# Altium schematic sheet [2] MCU.SchDoc: BLE SoC
size A4; ApprovedBy: Muhammet YILDIZ; CheckedBy: Muhammet YILDIZ; Author: Muhammet YILDIZ; CompanyName: YıLDıZ IoT; DrawnBy: Muhammet YILDIZ; Engineer: Muhammet YILDIZ; Organization: YıLDıZ IoT; Address1: Elperek Mahallesi; Address2: Saray Sokak No:12; Address3: SAKARYA / TURKEY; Revision: 1; SheetNumber: 2; SheetTotal: 7; SheetSize: A4
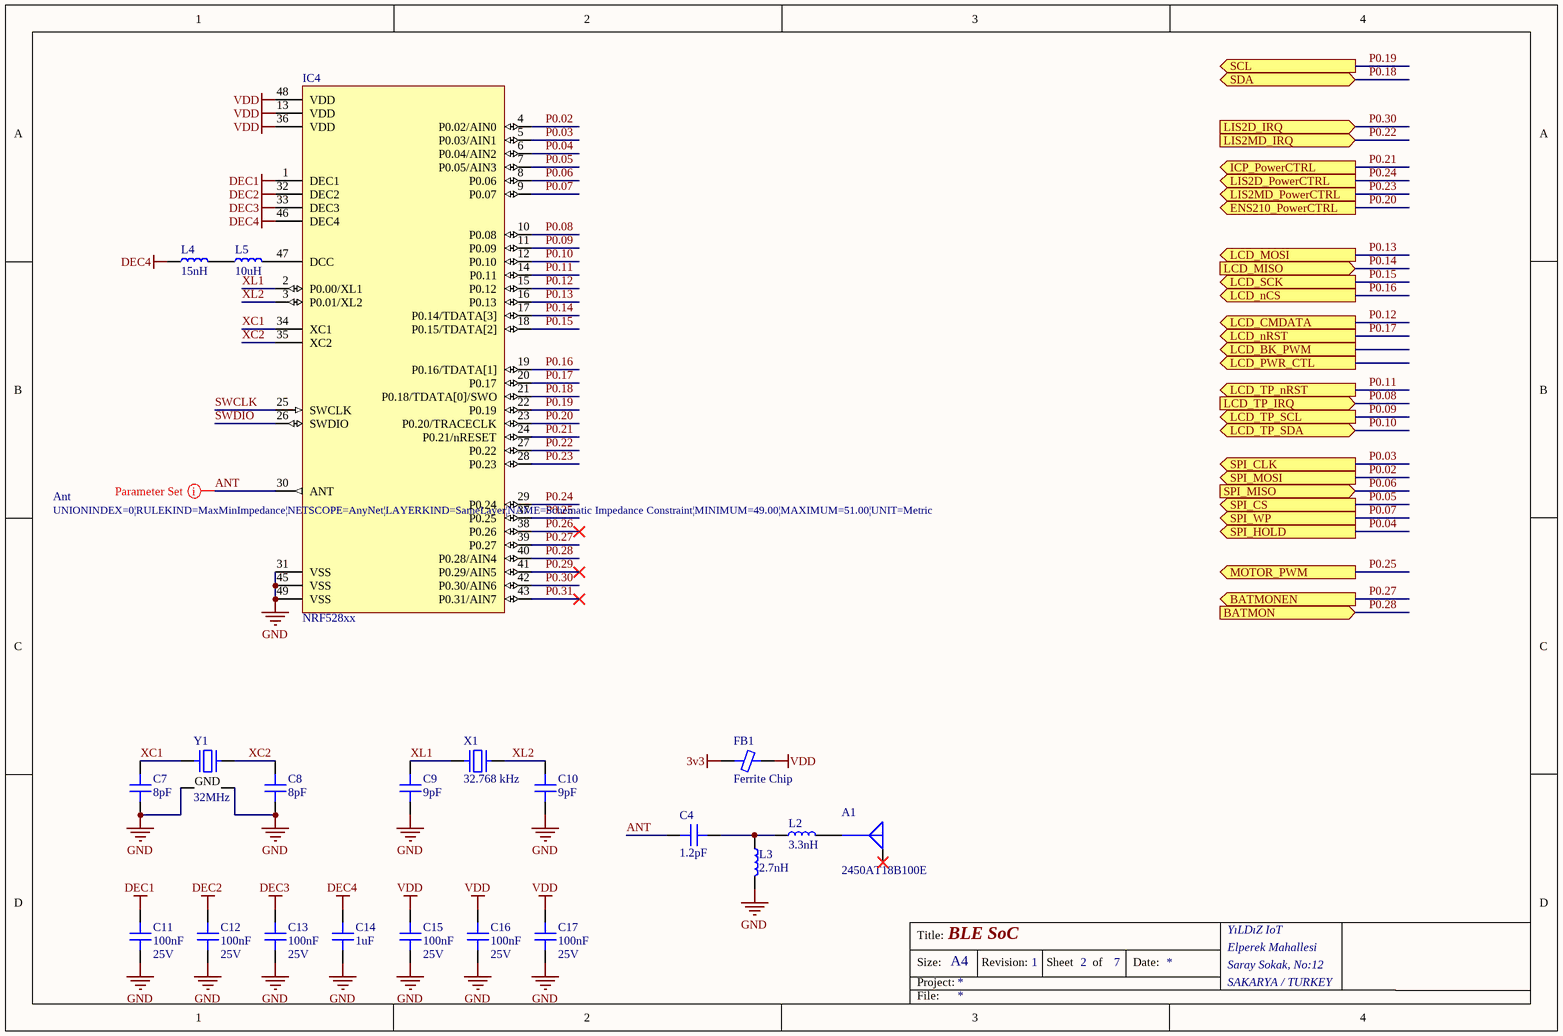
[diagram p0: [2] MCU.SchDoc]

## Parts
A1  2450AT18B100E  [ANTC3216X140N]
C4  1.2pF  [CAP 0402/1005]
C7  8pF  [CAP 0402/1005]
C8  8pF  [CAP 0402/1005]
C9  9pF  [CAP 0402/1005]
C10  9pF  [CAP 0402/1005]
C11  100nF  Voltage Rating (DC): 25V  [CAP 0402/1005]
C12  100nF  Voltage Rating (DC): 25V  [CAP 0402/1005]
C13  100nF  Voltage Rating (DC): 25V  [CAP 0402/1005]
C14  1uF  [CAP 0402/1005]
C15  100nF  Voltage Rating (DC): 25V  [CAP 0402/1005]
C16  100nF  Voltage Rating (DC): 25V  [CAP 0402/1005]
C17  100nF  Voltage Rating (DC): 25V  [CAP 0402/1005]
FB1  Ferrite Chip  [FER 0402/1005]  (no BOM)
IC4  NRF528xx  [QFN40P600X600X90-48N]
L2  3.3nH  [IND 0402/1005 RF WW]
L3  2.7nH  [IND 0402/1005 RF WW]
L4  15nH  [IND 0402/1005 RF WW]
L5  10uH  [IND 0603/1608 RF]
X1  32.768 kHz  [ABRACON ABS06]
Y1  32MHz  [KYOCERA CX2016DB]

## Ports
BATMON (in), BATMONEN (out), ENS210_PowerCTRL (out), ICP_PowerCTRL (out), LCD_BK_PWM (out), LCD_CMDATA (out), LCD_MISO (in), LCD_MOSI (out), LCD_nCS (out), LCD_nRST (out), LCD_PWR_CTL (out), LCD_SCK (out), LCD_TP_IRQ (in), LCD_TP_nRST (out), LCD_TP_SCL (out), LCD_TP_SDA (bidir), LIS2D_IRQ (in), LIS2D_PowerCTRL (out), LIS2MD_IRQ (in), LIS2MD_PowerCTRL (out), MOTOR_PWM (out), SCL (out), SDA (bidir), SPI_CLK (out), SPI_CS (out), SPI_HOLD (out), SPI_MISO (in), SPI_MOSI (out), SPI_WP (out)

## Nets
3v3: FB1.1
DEC1: C11.2 IC4.1(DEC1)
DEC2: C12.2 IC4.32(DEC2)
DEC3: C13.2 IC4.33(DEC3)
DEC4: C14.2 IC4.46(DEC4) L4.1
GND: C7.1 C8.1 C9.1 C10.1 C11.1 C12.1 C13.1 C14.1 C15.1 C16.1 C17.1 IC4.31(VSS) IC4.45(VSS) IC4.49(VSS) L3.2 Y1.2(GND) Y1.4(GND)
VDD: C15.2 C16.2 C17.2 FB1.2 IC4.13(VDD) IC4.36(VDD) IC4.48(VDD)
ANT: C4.2 IC4.30(ANT)
P0.02: IC4.4(P0.02/AIN0) ; port SPI_MOSI
P0.03: IC4.5(P0.03/AIN1) ; port SPI_CLK
P0.04: IC4.6(P0.04/AIN2) ; port SPI_HOLD
P0.05: IC4.7(P0.05/AIN3) ; port SPI_CS
P0.06: IC4.8(P0.06) ; port SPI_MISO
P0.07: IC4.9(P0.07) ; port SPI_WP
P0.08: IC4.10(P0.08) ; port LCD_TP_IRQ
P0.09: IC4.11(P0.09) ; port LCD_TP_SCL
P0.10: IC4.12(P0.10) ; port LCD_TP_SDA
P0.11: IC4.14(P0.11) ; port LCD_TP_nRST
P0.12: IC4.15(P0.12) ; port LCD_CMDATA
P0.13: IC4.16(P0.13) ; port LCD_MOSI
P0.14: IC4.17(P0.14/TDATA[3]) ; port LCD_MISO
P0.15: IC4.18(P0.15/TDATA[2]) ; port LCD_SCK
P0.16: IC4.19(P0.16/TDATA[1]) ; port LCD_nCS
P0.17: IC4.20(P0.17) ; port LCD_nRST
P0.18: IC4.21(P0.18/TDATA[0]/SWO) ; port SDA
P0.19: IC4.22(P0.19) ; port SCL
P0.20: IC4.23(P0.20/TRACECLK) ; port ENS210_PowerCTRL
P0.21: IC4.24(P0.21/nRESET) ; port ICP_PowerCTRL
P0.22: IC4.27(P0.22) ; port LIS2MD_IRQ
P0.23: IC4.28(P0.23) ; port LIS2MD_PowerCTRL
P0.24: IC4.29(P0.24) ; port LIS2D_PowerCTRL
P0.25: IC4.37(P0.25) ; port MOTOR_PWM
P0.26: IC4.38(P0.26)
P0.27: IC4.39(P0.27) ; port BATMONEN
P0.28: IC4.40(P0.28/AIN4) ; port BATMON
P0.29: IC4.41(P0.29/AIN5)
P0.30: IC4.42(P0.30/AIN6) ; port LIS2D_IRQ
P0.31: IC4.43(P0.31/AIN7)
SWCLK: IC4.25(SWCLK)
SWDIO: IC4.26(SWDIO)
XC1: C7.2 IC4.34(XC1) Y1.1
XC2: C8.2 IC4.35(XC2) Y1.3
XL1: C9.2 IC4.2(P0.00/XL1) X1.1
XL2: C10.2 IC4.3(P0.01/XL2) X1.2
NetA1_S: A1.S L2.2
NetC4_1: C4.1 L2.1 L3.1
NetIC4_47: IC4.47(DCC) L5.2
NetL4_2: L4.2 L5.1

Not connected (* = marked no-connect by the designer): A1 G*; IC4 44(NC)

## Layout directives
rule Impedance Constraint [Min = 49.00    Max = 51.00    ]; net class Ant: ANT

## Notes on the sheet
- Title:
- Size:
- Project:
- Revision:
- Sheet
- of
- Date:
- YıLDıZ IoT
- Elperek Mahallesi
- Saray Sokak, No:12
- SAKARYA / TURKEY
- File:

## Library data of the parts
A1 = Antenna: Antenna Chip -0.5dBi Gain 2500MHz 2-Pin CSMD T/R; Manufacturer: Johanson; Impedance: 50R; Bandwidth: 100MHz; Power Rating: 3W; Number of Bands: 1; Return Loss: -9.5dB; Frequency: 2.45GHz; Max Frequency: 2.5GHz; Gain: -0.5dB; Min Frequency: 2.4GHz; Supplier 1: Digi-Key; Supplier Part Number 1: 712-1006-1-ND; Manufacturer Part Number: 2450AT18B100E; RoHS: Yes; Category: RF Antennas; Stock 1: 432864; Pricing 1: 1=0,56000, 10=0,49500, 25=0,46480, 100=0,37950, 250=0,35248, 500=0,30000, 1000=0,24000 (USD); Mount: Surface Mount; Case/Package: CSMD; Contact Plating: Tin; Min Operating Temperature: -40°C; Max Operating Temperature: 85°C; Package Quantity: 1; Packaging: Tape and Reel; Max Power Dissipation: 3W; Termination: Solder; Series: -; Input Impedance: 50R; Input Power: 3W; Length: 3.2mm; Width: 1.6mm; Height: 0.051inch; Radiation Hardening: No; REACH SVHC: No SVHC; RoHS Compliant: Yes; ComponentLink1URL: https://datasheet.ciiva.com/24025/antenna-2450at18b100-242422-24025839.pdf?src-supplier=Mouser; ComponentLink1Description: https://datasheet.ciiva.com/24025/antenna-2450at18b100-242422-24025839.pdf?src-supplier=Mouser; ComponentLink2URL: https://datasheet.ciiva.com/1124/1318299-1124918.pdf?src-supplier=Element14; ComponentLink2Description: https://datasheet.ciiva.com/1124/1318299-1124918.pdf?src-supplier=Element14
C4 = Capacitor - Ceramic: Cap Ceramic 1.2pF 50V C0G 0.1pF SMD 0402 125C Paper T/R; Manufacturer: Johanson; Manufacturer Part Number: 500R07S1R2BV4T; Supplier 1: Digi-Key; Supplier Part Number 1: 712-1268-1-ND; RoHS: Yes; Category: Ceramic Capacitors; Stock 1: 1153; Pricing 1: 1=0,19000, 10=0,13000, 50=0,07820, 100=0,06600, 500=0,04518, 1000=0,03997, 2500=0,03824, 5000=0,03476 (USD); Case/Package: 0402; Number of Pins: 2; Dielectric Material: Ceramic; Contact Plating: Tin,Matte; Case Code (Imperial): 0402; Case Code (Metric): 1005; Min Operating Temperature: -55°C; Max Operating Temperature: 125°C; Packaging: Tape and Reel; Capacitance: 1.2pF; Dielectric: C0G; Voltage Rating (DC): 50V; Voltage Rating: 50V; Termination: SMD/SMT; Package Quantity: 10000; Series: S; Construction: Flat; Length: 1.02mm; Width: 0.02inch; Height: 0.64mm; Depth: 0.51mm; Thickness: 0.024inch; Radiation Hardening: No; REACH SVHC: Unknown; RoHS Compliant: Yes; ComponentLink1URL: https://datasheet.ciiva.com/1461/1731432-1461669.pdf?src-supplier=Element14; ComponentLink1Description: https://datasheet.ciiva.com/1461/1731432-1461669.pdf?src-supplier=Element14; ComponentLink2URL: https://datasheet.ciiva.com/22697/1731432-22697547.pdf?src-supplier=Element14; ComponentLink2Description: https://datasheet.ciiva.com/22697/1731432-22697547.pdf?src-supplier=Element14; ComponentLink3URL: https://datasheet.ciiva.com/28495/1932950-28495023.pdf?src-supplier=Element14; ComponentLink3Description: https://datasheet.ciiva.com/28495/1932950-28495023.pdf?src-supplier=Element14
C7 C8 = Capacitor - Ceramic: 0402 8 pF 50 V ±0.25 pF Tolerance C0G/NP0 Multilayer Ceramic Capacitor; Manufacturer: Murata; Manufacturer Part Number: GJM1555C1H8R0CB01D; Voltage Rating: 50V; Dielectric: C0G; Supplier 1: Digi-Key; Supplier Part Number 1: 490-3109-1-ND; RoHS: Yes; Category: Ceramic Capacitors; Stock 1: 170937; Pricing 1: 1=0,12000, 10=0,08500, 50=0,04620, 100=0,03770, 500=0,02696, 1000=0,02118, 2500=0,01925, 5000=0,01771 (USD); Mount: Surface Mount; Case/Package: 0402; Case Code (Metric): 1005; Case Code (Imperial): 0402; Min Operating Temperature: -55°C; Max Operating Temperature: 125°C; Capacitance: 8pF; Packaging: Tape and Reel; Package Quantity: 1; Voltage Rating (DC): 50V; Termination: SMD/SMT; Series: GJM; Construction: Flat; Length: 1mm; Width: 0.02inch; Height: 0.5mm; Thickness: 0.022inch; Depth: 0.5mm; Radiation Hardening: No; Lead Free: Lead Free; RoHS Compliant: Yes; ComponentLink1URL: https://datasheet.ciiva.com/2989/product-2989255.pdf?src-supplier=Avnet; ComponentLink1Description: https://datasheet.ciiva.com/2989/product-2989255.pdf?src-supplier=Avnet; ComponentLink2URL: https://datasheet.ciiva.com/165/partnumbering-e-01-165050.pdf?src-supplier=Digi-Key; ComponentLink2Description: https://datasheet.ciiva.com/165/partnumbering-e-01-165050.pdf?src-supplier=Digi-Key; ComponentLink3URL: https://datasheet.ciiva.com/29534/partnumbering-e-01-29534170.pdf?src-supplier=Digi-Key; ComponentLink3Description: https://datasheet.ciiva.com/29534/partnumbering-e-01-29534170.pdf?src-supplier=Digi-Key; ComponentLink4URL: https://datasheet.ciiva.com/29534/partnumbering-e-01-29534171.pdf?src-supplier=Digi-Key; ComponentLink4Description: https://datasheet.ciiva.com/29534/partnumbering-e-01-29534171.pdf?src-supplier=Digi-Key
C9 C10 = Capacitor - Ceramic: Cap Ceramic 9pF 50V C0G 0.25pF SMD 0402 125°C Paper T/R; Manufacturer: Samsung; Manufacturer Part Number: CL05C090CB5NNNC; Supplier 1: Digi-Key; Supplier Part Number 1: 1276-1616-1-ND; RoHS: Yes; Category: Ceramic Capacitors; Stock 1: 152596; Pricing 1: 1=0,10000, 10=0,04800, 50=0,02620, 100=0,02140, 500=0,01528, 1000=0,01201, 2500=0,01092, 5000=0,01004 (USD); Mount: Surface Mount; Case/Package: 0402; Case Code (Metric): 1005; Case Code (Imperial): 0402; Min Operating Temperature: -55°C; Max Operating Temperature: 125°C; Packaging: Tape and Reel; Package Quantity: 1; Capacitance: 9pF; Voltage Rating: 50V; Dielectric: C0G; Voltage Rating (DC): 50V; Series: CL; Construction: Flat; Length: 1mm; Width: 0.02inch; Height: 0.5mm; Thickness: 0.022inch; Depth: 0.5mm; Radiation Hardening: No; RoHS Compliant: Yes; ComponentLink1URL: https://datasheet.ciiva.com/25803/cl05c090cb5nnnc-25803844.pdf?src-supplier=Digi-Key; ComponentLink1Description: https://datasheet.ciiva.com/25803/cl05c090cb5nnnc-25803844.pdf?src-supplier=Digi-Key
C11-C13 C15-C17 = Capacitor - Ceramic: Cap Ceramic 0.1uF 25V X5R 10% Pad SMD 0402 85¡ãC T/R / Multi Layer Ceramic Capacitor (MLCC); Manufacturer: Samsung; Manufacturer Part Number: CL05A104KA5NNNC; Supplier 1: Digi-Key; Supplier Part Number 1: 1276-1043-6-ND; RoHS: Yes; Category: Ceramic Capacitors; Pricing 1: 1=0,10000, 10=0,01100, 50=0,00600, 100=0,00490, 500=0,00346, 1000=0,00272, 2500=0,00248, 5000=0,00228 (USD); Mount: Surface Mount; Case/Package: 0402; Case Code (Imperial): 0402; Case Code (Metric): 1005; Min Operating Temperature: -55°C; Max Operating Temperature: 85°C; Capacitance: 100nF; Packaging: Tape and Reel; Tolerance: 10%; Package Quantity: 1; Voltage Rating: 25V; Dielectric: X5R; Voltage: 25V; Length: 1mm; Width: 0.02inch; Height: 0.5mm; Thickness: 0.022inch; Depth: 0.5mm; Radiation Hardening: No; Lead Free: Lead Free; ComponentLink1URL: https://datasheet.ciiva.com/25802/cl05a104ka5nnnc-25802704.pdf?src-supplier=Digi-Key; ComponentLink1Description: https://datasheet.ciiva.com/25802/cl05a104ka5nnnc-25802704.pdf?src-supplier=Digi-Key; ComponentLink2URL: https://datasheet.ciiva.com/16437/cl05a104ka5nnnc-16437369.pdf?src-supplier=Future+Electronics; ComponentLink2Description: https://datasheet.ciiva.com/16437/cl05a104ka5nnnc-16437369.pdf?src-supplier=Future+Electronics; ComponentLink3URL: https://datasheet.ciiva.com/26838/getdatasheetpartid-357412-26838142.pdf?src-supplier=Verical; ComponentLink3Description: https://datasheet.ciiva.com/26838/getdatasheetpartid-357412-26838142.pdf?src-supplier=Verical; ComponentLink4URL: https://datasheet.ciiva.com/26309/mlcc-catalogdownload2013-eng-26309014.pdf?src-supplier=Distrelec; ComponentLink4Description: https://datasheet.ciiva.com/26309/mlcc-catalogdownload2013-eng-26309014.pdf?src-supplier=Distrelec
C14 = Capacitor - Ceramic: Ceramic capacitor SMD-0402 1000nF /16V X5R# K +-10%, Samsung, RoHS; Manufacturer Part Number: CL05A105KO5NNNC; Tolerance: 10%; Voltage Rating: 16V; Dielectric: X5R; Supplier 1: Digi-Key; Supplier Part Number 1: 1276-1067-1-ND; Manufacturer: Samsung; RoHS: Yes; Category: Ceramic Capacitors; Stock 1: 5192112; Pricing 1: 1=0,10000, 10=0,04400, 50=0,02400, 100=0,01960, 500=0,01402, 1000=0,01101, 2500=0,01001, 5000=0,00921 (USD); Mount: Surface Mount; Case/Package: 0402; Contact Plating: Tin; Case Code (Metric): 1005; Case Code (Imperial): 0402; Min Operating Temperature: -55°C; Max Operating Temperature: 85°C; Packaging: Tape and Reel; Package Quantity: 1; Series: CL; Capacitance: 1uF; Voltage: 16V; Construction: Flat; Length: 1mm; Width: 0.02inch; Height: 0.5mm; Thickness: 0.022inch; Depth: 0.5mm; Radiation Hardening: No; RoHS Compliant: Yes; ComponentLink1URL: https://datasheet.ciiva.com/16207/cl05a105ko5nnnc-16207571.pdf?src-supplier=Future+Electronics; ComponentLink1Description: https://datasheet.ciiva.com/16207/cl05a105ko5nnnc-16207571.pdf?src-supplier=Future+Electronics; ComponentLink2URL: https://datasheet.ciiva.com/15195/getdatasheetpartid-355272-15195629.pdf?src-supplier=Verical; ComponentLink2Description: https://datasheet.ciiva.com/15195/getdatasheetpartid-355272-15195629.pdf?src-supplier=Verical
FB1 = Ferrite Chip: SMT Ferrite Chip
IC4 = NRF528xx: Manufacturer: Nordic Semiconductor ASA; Manufacturer Part Number: NRF52832-QFAB-R; Satıcı: Digikey; RF Family/Standard: Bluetooth, General ISM > 1GHz; Frequency: 2.4GHz; Sensitivity: -96dBm; Power Output: 4dBm; Data Rate: 2Mbps; Current Receiving: 6,5mA; Voltage Supply: 1.7 - 3.6 V; Memory Size: 256kB Flash, 32kB RAM; Current Transmitting: 7,1mA; Protocol: ANT, Bluetooth v4.0; Serial Interfaces: I²C, SPI, UART; GPIO: 32; Depo Kodu: *; Package / Case: 48-VFQFN Exposed Pad; Satın Alma Linki: *; Datasheet: http://infocenter.nordicsemi.com/pdf/nRF52832_PS_v1.4.pdf; Suplier Code: *; Modulation: -; Operating Temperature: -40°C ~ 85°C; Mounting Type: Surface Mount; Type: TxRx + MCU; Value: NRF528xx
L2 = Inductor Air Core: Inductor RF Chip Multi-Layer 0.0033uH 0.3nH 100MHz 8Q-Factor Ceramic 0.3A 0.19Ohm DCR 0402 T/R; Manufacturer: Johanson; Manufacturer Part Number: L-07C3N3SV6T; Current Rating: 300mA; Shielding: Unshielded; Q Factor: 8; DC Resistance (DCR): 190mR; Self Resonant Frequency: 21GHz; Supplier 1: Digi-Key; Supplier Part Number 1: 712-1416-1-ND; RoHS: Yes; Category: Fixed Inductors; Stock 1: 842404; Pricing 1: 1=0,10000, 10=0,05000, 25=0,04480, 50=0,04000, 100=0,03390, 250=0,02992, 500=0,02744, 1000=0,02344, 2500=0,02095 (USD); Mount: Surface Mount; Case/Package: 0402; Number of Pins: 2; Case Code (Metric): 1005; Case Code (Imperial): 0402; Core Material: Ceramic; Weight: 2.3E-05oz; Min Operating Temperature: -40°C; Max Operating Temperature: 100°C; Packaging: Cut Tape; Package Quantity: 10000; Inductance: 3.3nH; Test Frequency: 100MHz; Max DC Current: 300mA; Termination: SMD/SMT; DC Current: 300mA; Series: L-07; Length: 1mm; Width: 0.5mm; Height: 0.5mm; Height - Seated (Max): 0.024inch; Depth: 0.6mm; Radiation Hardening: No; REACH SVHC: No SVHC; Military Standard: Not; RoHS Compliant: Yes; ComponentLink1URL: https://datasheet.ciiva.com/1473/1168792-1473902.pdf?src-supplier=Element14; ComponentLink1Description: https://datasheet.ciiva.com/1473/1168792-1473902.pdf?src-supplier=Element14
L3 = Inductor Air Core: Inductor RF Chip Multi-Layer 0.0027uH 0.3nH 100MHz 8Q-Factor Ceramic 0.3A 0.17Ohm DCR 0402 T/R; Manufacturer: Johanson; Manufacturer Part Number: L-07C2N7SV6T; Q Factor: 8; Current Rating: 300mA; Shielding: Unshielded; DC Resistance (DCR): 170mR; Self Resonant Frequency: 9.5GHz; Supplier 1: Digi-Key; Supplier Part Number 1: 712-1415-1-ND; RoHS: Yes; Category: Fixed Inductors; Stock 1: 895162; Pricing 1: 1=0,10000, 10=0,05000, 25=0,04480, 50=0,04000, 100=0,03390, 250=0,02992, 500=0,02744, 1000=0,02344, 2500=0,02095 (USD); Mount: Surface Mount; Case/Package: 0402; Number of Pins: 2; Case Code (Metric): 1005; Case Code (Imperial): 0402; Weight: 2.3E-05oz; Core Material: Ceramic; Contact Plating: Tin,Matte; Min Operating Temperature: -40°C; Max Operating Temperature: 100°C; Packaging: Tape and Reel; Package Quantity: 1; Inductance: 2.7nH; Test Frequency: 100MHz; Max DC Current: 300mA; Termination: SMD/SMT; DC Current: 300mA; Series: -; Length: 1mm; Width: 0.02inch; Height: 0.5mm; Height - Seated (Max): 0.024inch; Depth: 0.6mm; Radiation Hardening: No; REACH SVHC: No SVHC; Military Standard: Not; RoHS Compliant: Yes; ComponentLink1URL: https://datasheet.ciiva.com/1473/1168792-1473898.pdf?src-supplier=Element14; ComponentLink1Description: https://datasheet.ciiva.com/1473/1168792-1473898.pdf?src-supplier=Element14
L4 = Inductor Air Core: Ind High Frequency Chip Multi-Layer 15nH 5% 100MHz 8Q-Factor Ceramic 320mA 0402 T/R; Manufacturer: Taiyo Yuden; Manufacturer Part Number: HK100515NJ-T; Core Material: Ferrite,Ceramic; Shielding: Unshielded; Self Resonant Frequency: 2.3GHz; Q Factor: 8; DC Resistance (DCR): 460mR; Max DC Current: 300mA; Supplier 1: Avnet; Supplier Part Number 1: HK100515NJ-T; RoHS: Yes; Category: Fixed Inductors; Mount: Surface Mount; Case/Package: 0402; Number of Pins: 2; Case Code (Metric): 1005; Case Code (Imperial): 0402; Body Material: Ceramic; Min Operating Temperature: -55°C; Max Operating Temperature: 125°C; Packaging: Tape and Reel; Inductance: 15nH; Current Rating: 320mA; Package Quantity: 10000; Test Frequency: 100MHz; Termination: SMD/SMT; Tolerance: 5%; Series: HK; Inductance Tolerance: 5%; DC Current: 320mA; Length: 0.039inch; Width: 0.02inch; Height: 0.5mm; Height - Seated (Max): 0.022inch; Depth: 0.55mm; Radiation Hardening: No; RoHS Compliant: Yes; Lead Free: Exempt; Halogen Free: Halogen Free; REACH SVHC: Unknown; Military Standard: Not; ComponentLink1URL: https://datasheet.ciiva.com/6688/hk100515nj-t-ss-6688640.pdf?src-supplier=Digi-Key; ComponentLink1Description: https://datasheet.ciiva.com/6688/hk100515nj-t-ss-6688640.pdf?src-supplier=Digi-Key; ComponentLink2URL: https://datasheet.ciiva.com/8498/hk100515nj-t-ss-8498917.pdf?src-supplier=Avnet; ComponentLink2Description: https://datasheet.ciiva.com/8498/hk100515nj-t-ss-8498917.pdf?src-supplier=Avnet; ComponentLink3URL: https://datasheet.ciiva.com/26871/getdatasheetpartid-645793-26871605.pdf?src-supplier=Verical; ComponentLink3Description: https://datasheet.ciiva.com/26871/getdatasheetpartid-645793-26871605.pdf?src-supplier=Verical; ComponentLink4URL: https://datasheet.ciiva.com/15986/1443hk100515nj-t-15986294.pdf?src-supplier=Onlinecomponents.com; ComponentLink4Description: https://datasheet.ciiva.com/15986/1443hk100515nj-t-15986294.pdf?src-supplier=Onlinecomponents.com; ComponentLink5URL: https://datasheet.ciiva.com/30215/1387hk100515nj-t-30215366.pdf?src-supplier=Onlinecomponents.com; ComponentLink5Description: https://datasheet.ciiva.com/30215/1387hk100515nj-t-30215366.pdf?src-supplier=Onlinecomponents.com
L5 = Inductor Air Core: Inductor Chip Wirewound 10uH 10% 2.52MHz Ferrite 80mA 468mOhm DCR 0603 T/R; Manufacturer: Taiyo Yuden; Manufacturer Part Number: LBMF1608T100K; Self Resonant Frequency: 32MHz; Shielding: Unshielded; DC Resistance (DCR): 360mR; Supplier 1: Digi-Key; Supplier Part Number 1: 587-1714-1-ND; RoHS: Yes; Category: Fixed Inductors; Stock 1: 1662; Pricing 1: 1=0,25000, 10=0,22300, 25=0,19800, 50=0,16840, 100=0,14850, 250=0,13612, 500=0,12376, 1000=0,10395 (USD); Mount: Surface Mount; Case/Package: 0603; Core Material: Ferrite; Case Code (Metric): 1608; Case Code (Imperial): 0603; Weight: 7.1E-05oz; Min Operating Temperature: -40°C; Max Operating Temperature: 105°C; Packaging: Tape and Reel; Inductance: 10uH; Inductance Tolerance: 10%; Package Quantity: 3000; Tolerance: 10%; Current Rating: 80mA; Resistor Type: Wirewound; Test Frequency: 2.52MHz; Max DC Current: 80mA; Termination: SMD/SMT; DC Current: 80mA; Series: LB; Length: 0.063inch; Width: 0.031inch; Height: 0.35mm; Height - Seated (Max): 0.039inch; Lead Pitch: 0.7mm; Depth: 0.9mm; Radiation Hardening: No; Lead Free: Lead Free; Halogen Free: Halogen Free; REACH SVHC: Unknown; Military Standard: Not; RoHS Compliant: Yes; ComponentLink1URL: https://datasheet.ciiva.com/8504/lbmf1608t100k-ss-8504740.pdf?src-supplier=Avnet; ComponentLink1Description: https://datasheet.ciiva.com/8504/lbmf1608t100k-ss-8504740.pdf?src-supplier=Avnet; ComponentLink2URL: https://datasheet.ciiva.com/26872/getdatasheetpartid-637440-26872437.pdf?src-supplier=Verical; ComponentLink2Description: https://datasheet.ciiva.com/26872/getdatasheetpartid-637440-26872437.pdf?src-supplier=Verical; ComponentLink3URL: https://datasheet.ciiva.com/1040/lbmf1608t100k-ss-1040360.pdf?src-supplier=Digi-Key; ComponentLink3Description: https://datasheet.ciiva.com/1040/lbmf1608t100k-ss-1040360.pdf?src-supplier=Digi-Key; ComponentLink4URL: https://datasheet.ciiva.com/15986/610lbmf1608t100k-15986589.pdf?src-supplier=Onlinecomponents.com; ComponentLink4Description: https://datasheet.ciiva.com/15986/610lbmf1608t100k-15986589.pdf?src-supplier=Onlinecomponents.com; ComponentLink5URL: https://datasheet.ciiva.com/46395/1497259-46395174.pdf?src-supplier=Element14; ComponentLink5Description: https://datasheet.ciiva.com/46395/1497259-46395174.pdf?src-supplier=Element14
X1 = Abracon Crystal ABS06: Crystal 32.7680KHZ 9PF SMD; Manufacturer: Micro Crystal; Manufacturer Part Number: CM8V-T1A-32.768KHZ-9PF-20PPM-TA-QC; Supplier 1: Digi-Key; Supplier Part Number 1: 2195-CM8V-T1A-32.768KHZ-9PF-20PPM-TA-QCDKR-ND; RoHS: No; Stock 1: 55147; Pricing 1: 1=0,66000, 10=0,54700, 50=0,49260, 100=0,43780, 500=0,41592 (USD); Frequency: 32.768 kHz
Y1 = CX2016DB32000D0WZRC1: CRYSTAL 32.0000MHZ 8PF SMD; Manufacturer: Kyocera International Inc. Electronic Components; ESR (Equivalent Series Resistance): 60 Ohms; Frequency Stability: ±40ppm; Frequency Tolerance: ±25ppm; Operating Mode: Fundamental; Part Number: CX2016DB32000D0WZRC1; ComponentLink1Description: Datasheet; ComponentLink1URL: https://global.kyocera.com/prdct/electro/product/pdf/cx2016db_e.pdf; ComponentLink2Description: DigiKey Link; ComponentLink2URL: http://digikey.com/product-detail/en/kyocera-international-inc-electronic-components/CX2016DB32000D0WZRC1/1253-1586-1-ND/5436848; Frequency: 32MHz; Height - Seated (Max): 0.018" (0.45mm); LastUpdated: 02.09.2020 01:21:56; Lifecycle Status: Active; Load Capacitance: 8pF; Minimum Order: 1; Mounting Type: Surface Mount; Operating Temperature: -25°C ~ 75°C; Package / Case: 4-SMD, No Lead; Packaging: TapeAndReel; PartId: 466; Part Status: Active; Price: 0.36; Series: CX2016DB, Kyocera; Size / Dimension: 0.079" L x 0.063" W (2.00mm x 1.60mm); Supplier 1: DigiKey; Supplier Part Number 1: 1253-1586-1-ND; Type: MHz Crystal; Value: 32MHz